# Altium schematic sheet Axis_Potentiometer.SchDoc
size A; SheetNumber: 5; SheetTotal: 4
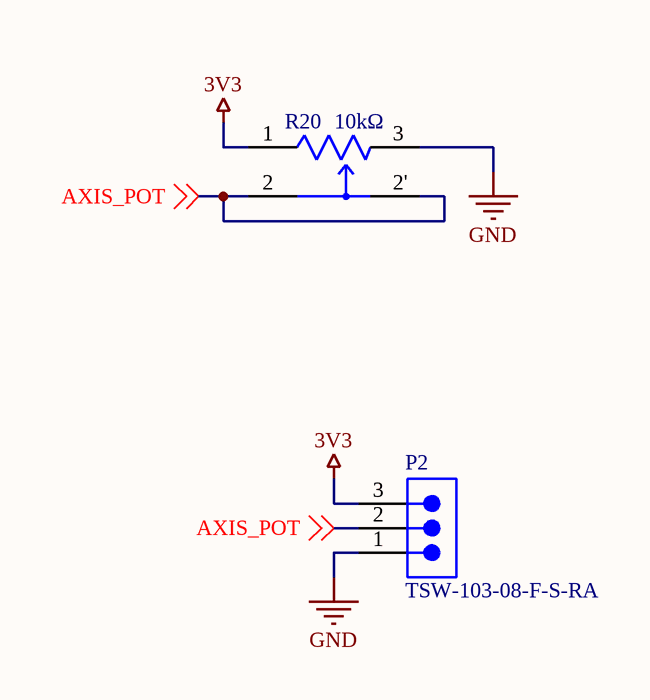
[diagram p0: Axis_Potentiometer.SchDoc]

## Parts
P2  TSW-103-08-F-S-RA  [SMTC-TSW-103-08-X-S-RA]
R20  Resistance: 10kΩ  [FP-EVW-AE4001B14-MFG]  (hidden comment: EVW-AE4001B14)

## Nets
3V3: P2.3 R20.1
GND: P2.1 R20.3
AXIS_POT: P2.2 R20.2 R20.2' ; off-sheet AXIS_POT

## Library data of the parts
P2 = CMP-1024-00344-1: 0.025" SQ Post Header, Through-hole, Right Angle, -55 to 125 degC, 2.54 mm Pitch, 3-Pin, Male, RoHS; Manufacturer: Samtec; Pitch: 2.54 mm; PackageVersion: DM, 8/1988; ComponentLink3Description: Package Specification; ComponentLink2Description: Datasheet; PackageDescription: .025[0.64] SQ. Post Terminal Strip Assembly; ComponentLink3URL: http://www.samtec.com/documents/webfiles/cpdf/TSW-XXX-XX-XXX-X-XX-XXX-MKT.pdf; ComponentLink1URL: http://www.samtec.com; Mounting Technology: Through-hole; ComponentLink2URL: http://www.samtec.com/documents/webfiles/pdf/TSW_TH.PDF; RoHS: True; Temperature Range: -55 to 125 degC; Orientation: Right Angle; DatasheetVersion: F-214; ComponentLink1Description: Manufacturer URL; PackageReference: TSW-103-08-X-S-RA; PartNumber: TSW-103-08-F-S-RA
R20 = CMP-00287-39595731-1: EVW-AE4001B14 Res POT 10K Ohm 30% 1/20W 4mm (10.6 X 15.4 X 3.4mm) Thru-Hole Embossed T/R; Max Supply Voltage: 5V; Power Rating: 50mW; Sensing Method: Resistive; Linearity: 2%; Min Operating Temperature: -40°C; Tolerance: 30%; NexarPartId: 39595731; Termination: SMD/SMT; Contact Plating: Silver; Mount: Surface Mount, Through Hole; Packaging: Cut Tape; Length: 10.6mm; Lead Free: Lead Free; Depth: 15.4mm; RoHS: Compliant; Military Standard: Not; Radiation Hardening: No; Composition: Potentiometer; Min Supply Voltage (DC): 5V; Schedule B: 8536509065, 8536509065; Max Operating Temperature: 85°C; Number of Pins: 4; Type: Potentiometer; REACH SVHC: Unknown